# Altium schematic sheet NRF24L01_SPI#3.SchDoc
size A4; DocumentNumber: 2; SheetNumber: 2; SheetTotal: 2
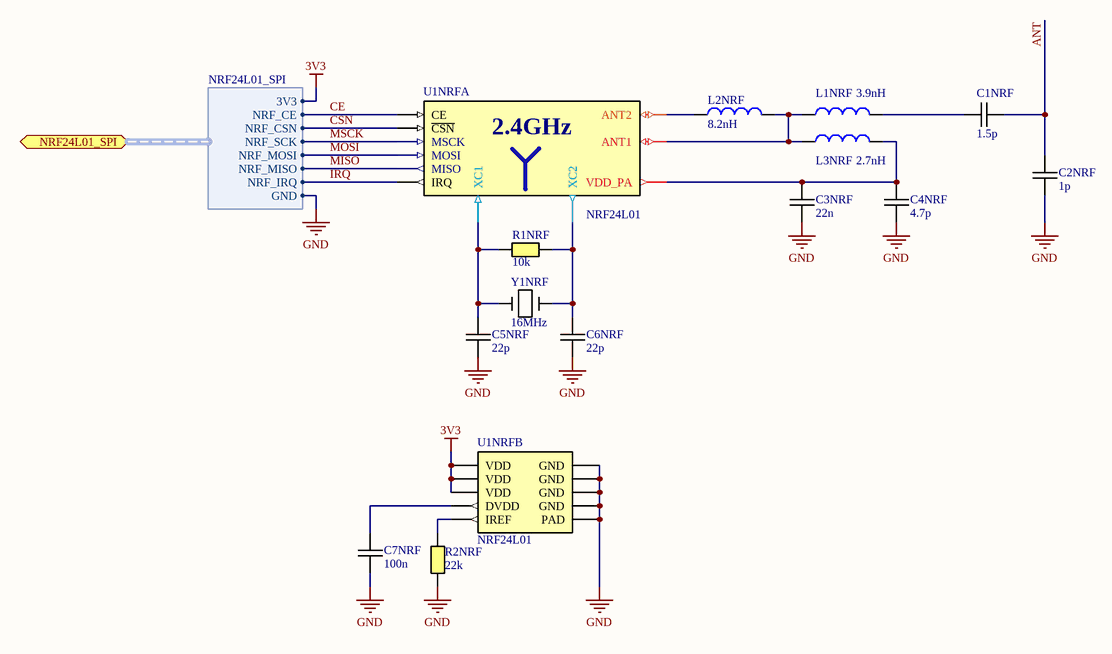
[diagram p0: NRF24L01_SPI#3.SchDoc]

## Parts
C1NRF  1.5p  [CAPC0603(1608)55_L]
C2NRF  value 1p  [CAPC0603(1608)55_L]  (hidden comment: 1.5p)
C3NRF  22n  [CAPC0603(1608)55_L]
C4NRF  value 4.7p  [CAPC0603(1608)55_L]  (hidden comment: 22n)
C5NRF  22p  [CAPC0603(1608)55_L]
C6NRF  22p  [CAPC0603(1608)55_L]
C7NRF  value 100n  [CAPC0603(1608)55_L]  (hidden comment: 22n)
L1NRF  3.9nH  [CAPC0402(1005)33_L]
L2NRF  8.2nH  [CAPC0402(1005)33_L]
L3NRF  2.7nH  [CAPC0402(1005)33_L]
R1NRF  value 10k  [RESC0603(1608)_N]  (hidden comment: 1M)
R2NRF  22k  [RESC0603(1608)_N]
U1NRF  NRF24L01  [QFN20]  (parts A,B of 2)
Y1NRF  16MHz  [3225]

## Ports
NRF24L01_SPI (harness NRF24L01_SPI)

## Harnesses
NRF24L01_SPI: 3V3, NRF_CE, NRF_CSN, NRF_SCK, NRF_MOSI, NRF_MISO, NRF_IRQ, GND

## Nets
3V3: U1NRF.7(VDD) U1NRF.15(VDD) U1NRF.18(VDD) ; port NRF24L01_SPI.3V3
GND: C2NRF.1 C3NRF.2 C4NRF.2 C5NRF.2 C6NRF.2 C7NRF.2 R2NRF.2 U1NRF.8(GND) U1NRF.14(GND) U1NRF.17(GND) U1NRF.20(GND) U1NRF.21(PAD) Y1NRF.2 Y1NRF.4 ; port NRF24L01_SPI.GND
ANT: C1NRF.2 C2NRF.2
CE: U1NRF.1(CE) ; port NRF24L01_SPI.NRF_CE
CSN: U1NRF.2(~{CSN}) ; port NRF24L01_SPI.NRF_CSN
IRQ: U1NRF.6(IRQ) ; port NRF24L01_SPI.NRF_IRQ
MISO: U1NRF.5(MISO) ; port NRF24L01_SPI.NRF_MISO
MOSI: U1NRF.4(MOSI) ; port NRF24L01_SPI.NRF_MOSI
MSCK: U1NRF.3(MSCK) ; port NRF24L01_SPI.NRF_SCK
NetC1NRF_1: C1NRF.1 L1NRF.2
NetC3NRF_1: C3NRF.1 C4NRF.1 L3NRF.2 U1NRF.11(VDD_PA)
NetC5NRF_1: C5NRF.1 R1NRF.1 U1NRF.10(XC1) Y1NRF.1
NetC6NRF_1: C6NRF.1 R1NRF.2 U1NRF.9(XC2) Y1NRF.3
NetC7NRF_1: C7NRF.1 U1NRF.19(DVDD)
NetL1NRF_1: L1NRF.1 L2NRF.2 L3NRF.1 U1NRF.12(ANT1)
NetL2NRF_1: L2NRF.1 U1NRF.13(ANT2)
NetR2NRF_1: R2NRF.1 U1NRF.16(IREF)

## Notes on the sheet
- (in symbol NRF24L01, part A) 2.4GHz

## Library data of the parts
C1NRF C2NRF C3NRF C4NRF C5NRF C6NRF C7NRF = Capacitor H: Ceramic capacitor High density
  C1NRF: Value: 1.5p
  C3NRF: Value: 22n
  C5NRF C6NRF: Value: 22p
L1NRF L2NRF L3NRF = Inductor
  L1NRF: Value: 3.9nH
  L2NRF: Value: 8.2nH
  L3NRF: Value: 2.7nH
R1NRF R2NRF = Resistor M: Resistor Medium Density
  R2NRF: Value: 22k
U1NRF = NRF24L01: 2.4GHz WIRELESS TRANSIVER
Y1NRF = CRYSTAL: Value: 16MHz